# EasyEDA Pro project water-meter-v1.eprj, board PCB1
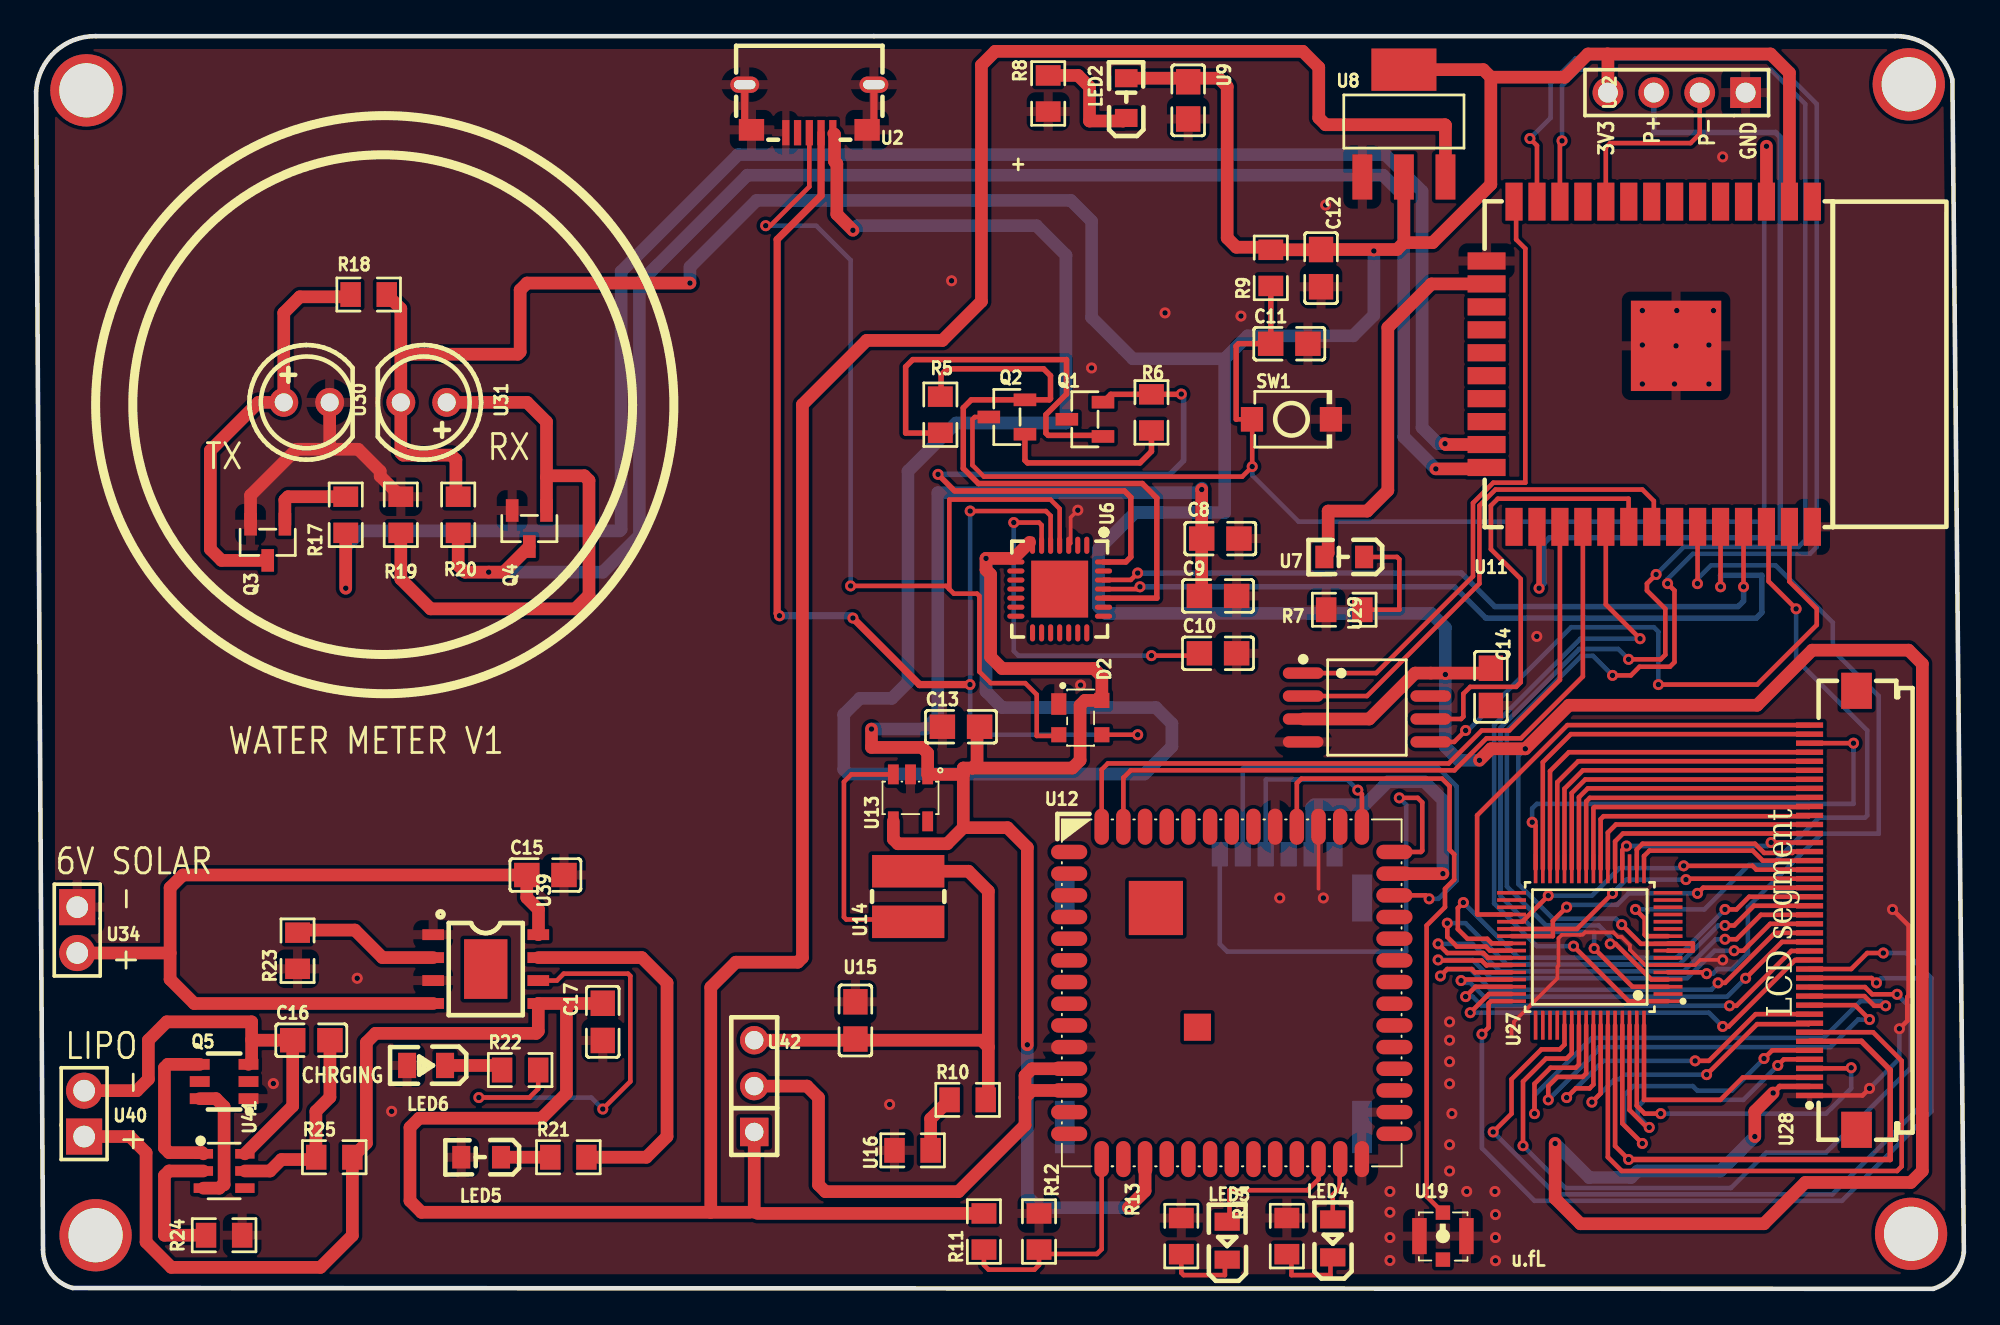
[diagram p1: board, top side]
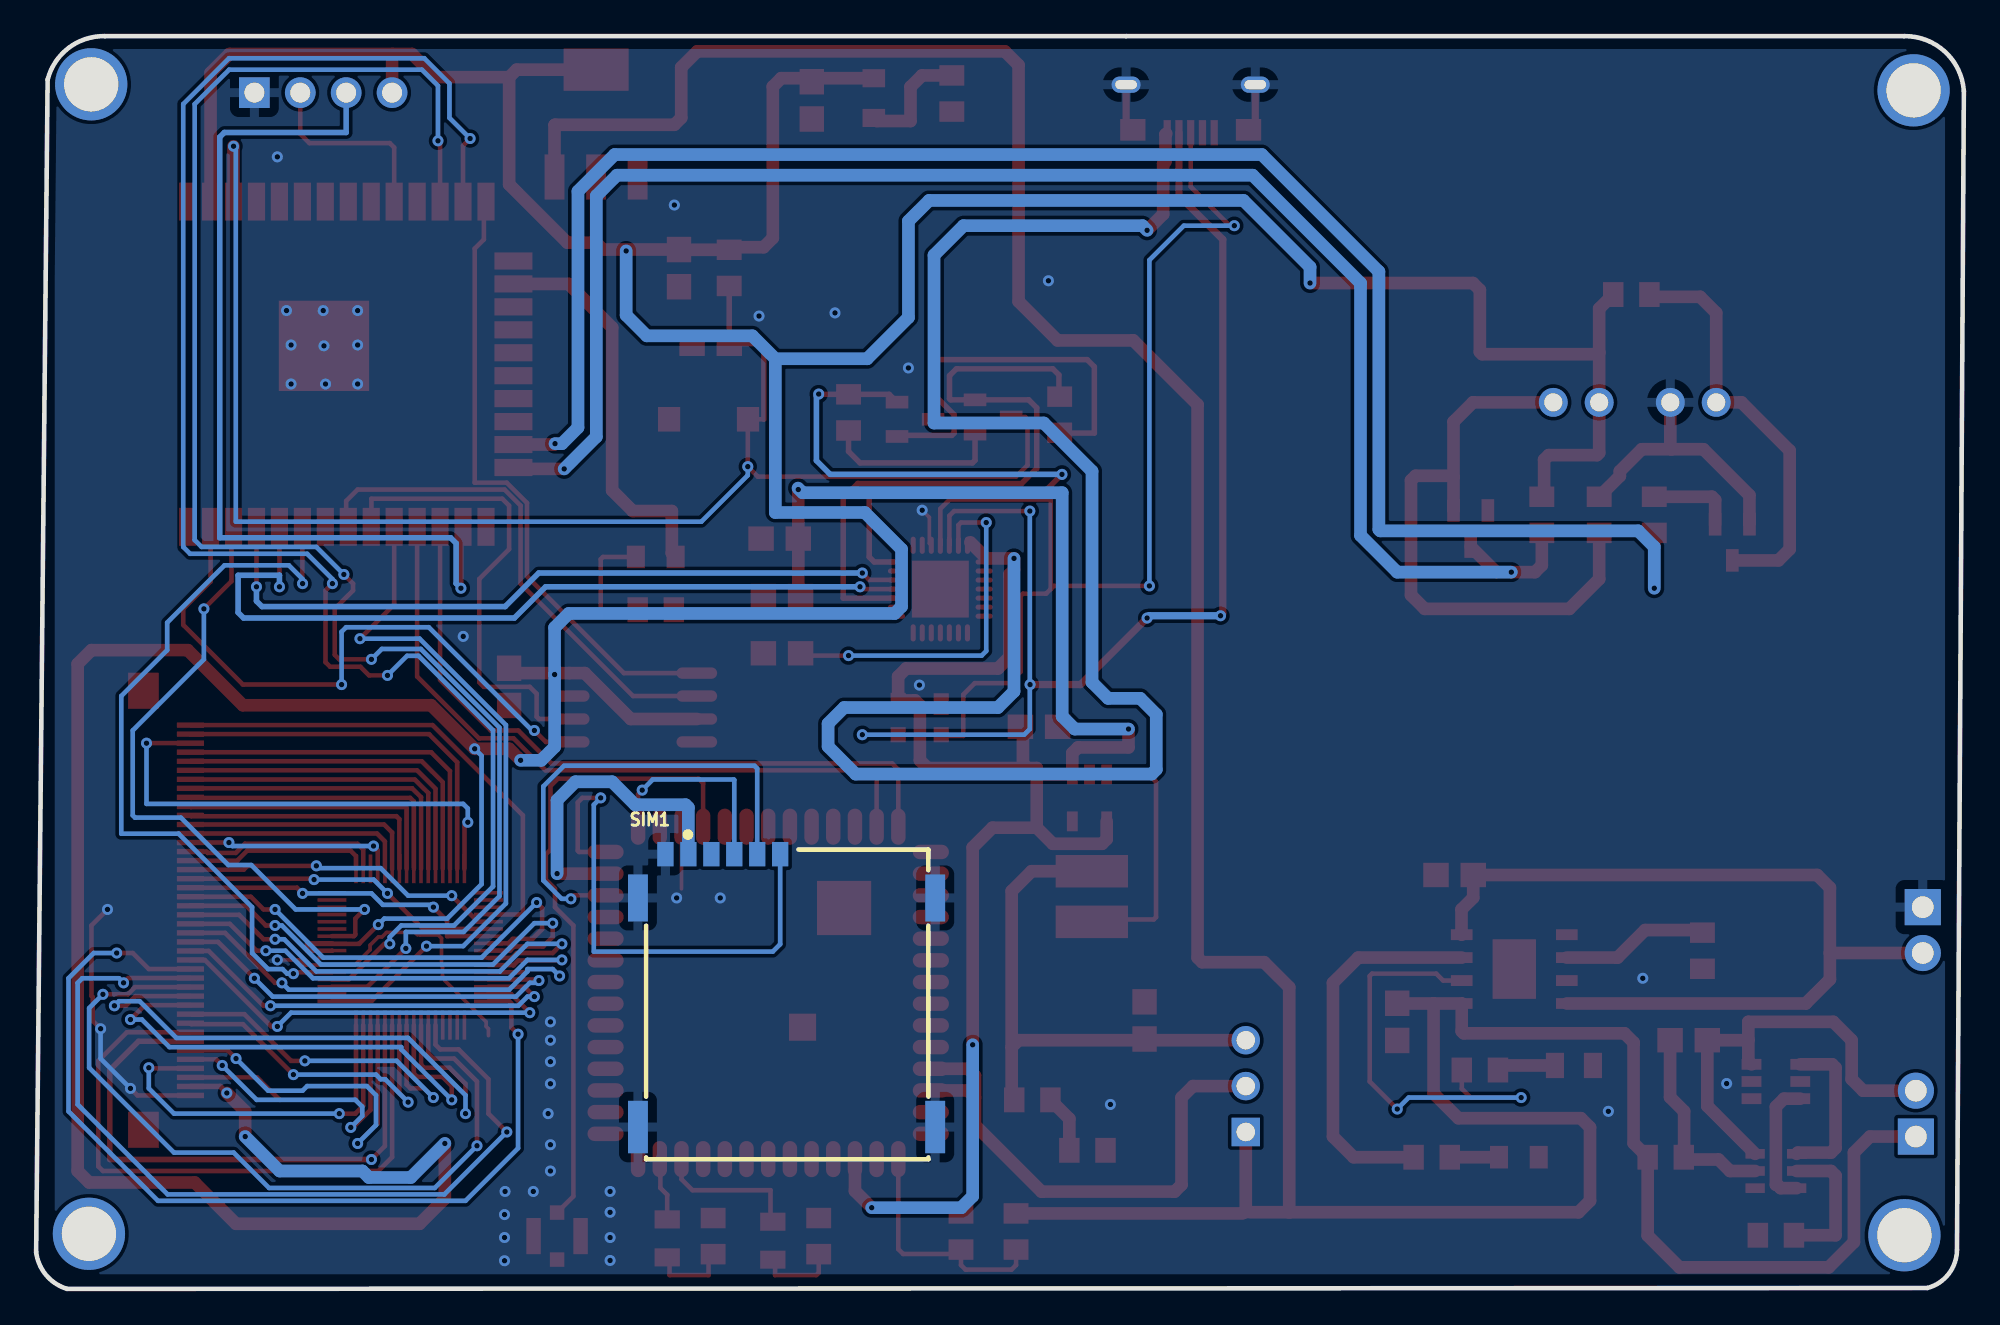
[diagram p2: board, bottom side, seen from below]

Outline 106.68 x 69.34 mm; copper layers: Top Layer, Bottom Layer. Coordinates in mm from the lower left corner of the outline.
Outline path: 0,66.29 0.38,2.16 arc(0.84,0.83) 2.02,0.05 104.97,0 arc(106.13,0.76) 106.68,2.03 106.05,66.93 arc(104.89,68.69) 102.88,69.34 3.3,69.34 arc(1.04,68.48) 0,66.29
Stack: Top Layer 0.035mm / Dielectric1 1.51mm FR4 er 4.5 / Bottom Layer 0.035mm

## Design rules (mm)
template: Custom Config
spacing copperThickness1oz (default): track to track 0.102, other pairs 0.152 to 0.3
spacing copperThickness2oz: track to track 0.203, other pairs 0.152 to 0.3
track width copperThickness1oz (default): min 0.127, default 0.254, max 2.54
track width copperThickness2oz: min 0.203, default 0.254, max 2.54
track width power: min 0.7, default 0.7, max 2.54
differential pair differentialPair (default): width min 0.127, default 0.254, max 2.54; gap min 0.152, default 0.152
via viaSize (default): diameter min 0.5, default 0.61, max 10; hole min 0.3, default 0.305, max 6.3
net VBUS uses power
net 3V3 uses power
net VSIM uses power

## Placement (name value [footprint] x y rotation side)
C8  1uF  [C0805]  65.53 41.53 0 top
C9  0.1uF  [C0805]  65.41 38.35 0 top
C10  0.1uF  [C0805]  65.41 35.18 0 top
C11  1uF  [C0805]  69.35 52.31 0 top
C12  10uF  [C0805]  71.11 56.5 270 top
C13  10uF  [C0805]  51.18 31.12 0 top
C14  100nF  [C0805]  80.51 33.32 270 top
C15  0.1uF  [C0805]  28.18 22.91 0 top
C16  0.1uF  [C0805]  15.23 13.76 0 top
C17  0.1uF  [C0805]  31.36 14.78 270 top
D2  SP0503BAHTG  [SOT-143-4_L2.9-W1.3-P1.92-LS2.4-BL]  57.78 31.62 270 top
LED2  D-R080508L3-KS2  [LED0805-RD]  60.32 65.91 90 top
LED3  KT-0805YG  [LED0805-R-RD]  65.91 2.67 90 top
LED4  KT-0805YG  [LED0805-R-RD]  71.75 2.79 90 top
LED5  RED  [LED0805-RD]  24.63 7.29 180 top
LED6  GRN  [LED0805-R-RD_GREEN]  21.58 12.37 180 top
NOREF  -  [Pad_e70]  103.76 3.05 0 top
NOREF#2  -  [Pad_e69]  103.63 66.68 0 top
NOREF#3  -  [Pad_e66]  2.78 66.34 0 top
NOREF#4  -  [Pad_e71]  3.29 2.97 0 top
Q1  MMBT2222A  [SOT-23-3_L2.9-W1.3-P1.90-LS2.4-BR]  58.04 48.13 0 top
Q2  MMBT2222A  [SOT-23-3_L2.9-W1.3-P1.90-LS2.4-BR]  53.72 48.26 0 top
Q3  MMBT2222A  [SOT-23-3_L2.9-W1.3-P1.90-LS2.4-BR]  12.81 41.32 90 top
Q4  MMBT2222A  [SOT-23-3_L2.9-W1.3-P1.90-LS2.4-BR]  27.29 42.09 90 top
Q5  FS8205A  [SOT-23-6_L2.9-W1.6-P0.95-LS2.8-BR]  10.4 11.48 0 top
R5  10kΩ  [R0805]  50.04 48.39 270 top
R6  10kΩ  [R0805]  61.72 48.51 270 top
R7  10kΩ  [R0805]  72.39 37.59 0 top
R8  10kΩ  [R0805]  56.01 66.17 90 top
R9  10kΩ  [R0805]  68.33 56.52 90 top
R10  330kΩ  [R0805]  51.55 10.46 0 top
R11  200kΩ  [R0805]  52.45 3.18 90 top
R12  100kΩ  [R0805]  55.5 3.18 270 top
R13  1kΩ  [R0805]  63.37 2.92 270 top
R14  1kΩ  [R0805]  69.22 2.92 270 top
R17  1kΩ  [R0805]  17.13 42.85 90 top
R18  270Ω  [R0805]  18.4 55.04 0 top
R19  100kΩ  [R0805]  20.18 42.85 270 top
R20  270Ω  [R0805]  23.36 42.85 90 top
R21  1kΩ  [R0805]  29.45 7.29 0 top
R22  1kΩ  [R0805]  26.78 12.11 0 top
R23  1.2kΩ  [R0805]  14.47 18.72 90 top
R24  1kΩ  [R0805]  10.4 2.97 0 top
R25  120Ω  [R0805]  16.5 7.29 0 top
SIM1  MICRO SIM 6P H1.35  [SIM-SMD_MICRO-SIM-6P-H1.35]  65.15 16.51 180 bottom
SW1  TS-1088R-02526  [SW-SMD_L3.9-W3.0-P4.45]  69.47 48.13 0 top
U2  USB-111HJ-B-CU  [MICRO-USB-SMD_HOOYA_USB-111HJ-B-CU]  42.79 65.33 180 top
U6  CP2102-GM  [QFN-28_L5.0-W5.0-P0.50-TL-EP3.2]  56.64 38.73 270 top
U7  YLED0805R  [LED0805-RD]  72.39 40.51 180 top
U8  AMS1117-3.3  [SOT-223-3_L6.5-W3.4-P2.30-LS7.0-BR]  75.69 64.52 270 top
U9  22uF  [C0805]  63.75 65.79 90 top
U11  ESP32-WROOM-32D-N4  [WIFIM-SMD_39P-L25.5-W18.0-P1.27-BL]  89.28 51.18 180 top
U12  A9G  [GSM-SMD_A9-GSM-GPRSMODULE]  66.17 16.38 0 top
U13  SY8089AAAC  [SOT-23-5_L3.0-W1.7-P0.95-LS2.8-BR]  48.39 27.18 90 top
U14  2.2uH  [IND-SMD_L4.5-W4.0_SLF0403-1]  48.26 21.72 90 top
U15  22uF  [C0805]  45.34 14.86 270 top
U16  56.2kΩ  [R0805]  48.5 7.67 0 top
U19  IPEX-1  [IPEX-SMD_4P-L2.6-W2.6-LS3.0]  77.85 2.92 180 top
U27  HT1622  [LQFP-64_L7.0-W7.0-P0.40-LS9.2-BL]  85.98 18.92 90 top
U28  FPC-0.5FX-42PH20  [FPC-SMD_42P-P0.50_YUANDI_FPC-0.5FX-42PH20]  99.44 20.96 90 top
U29  W25Q128JVSIQ  [SOIC-8_L5.3-W5.3-P1.27-LS8.0-BL]  73.65 32.18 270 top
U30  TSHG8200  [LED-TH_BD5.0-P2.54-FD-1]  14.97 49.07 0 top
U31  TSHG8200  [LED-TH_BD5.0-P2.54-FD-1]  21.45 49.07 180 top
U32  2.54-1*4  [HDR-TH_4P-P2.54-V-M-1]  90.79 66.22 180 top
U34  2.54-1*2  [HDR-TH_2P-P2.54-V-M]  2.27 19.86 270 top
U39  TP4056  [ESOP-8_L4.9-W3.9-P1.27-LS6.0-BL-EP]  24.88 17.7 270 top
U40  3.7V LiPo Battery  [HDR-TH_2P-P2.54-V-M]  2.66 9.7 90 top
U41  DW01A  [SOT-23-6_L2.9-W1.6-P0.95-LS2.8-BL]  10.4 6.53 270 top
U42  PM2.54-1*3  [HDR-TH_3P-P2.54-V-F]  39.74 11.22 90 top

## Footprints (pads in the part's own frame, mm; a bottom-side part is the same pattern mirrored in y, then rotated)
C0805
  rect 1.41x1.35 smd: 1(-1.03,0) 2(1.03,0)
ESOP-8_L4.9-W3.9-P1.27-LS6.0-BL-EP
  rect 0.6x1.2 smd: 1(-1.905,-2.909) 2(-0.635,-2.909) 3(0.635,-2.909) 4(1.905,-2.909) 5(1.905,2.909) 6(0.635,2.909) 7(-0.635,2.909) 8(-1.905,2.909)
  rect 3.3x2.4 smd: 9(0,0)
FPC-SMD_42P-P0.50_YUANDI_FPC-0.5FX-42PH20
  rect 0.3x1.5 smd: 1(-10.25,1.3) 2(-9.75,1.3) 3(-9.25,1.3) 4(-8.75,1.3) 5(-8.25,1.3) 6(-7.75,1.3) 7(-7.25,1.3) 8(-6.75,1.3) 9(-6.25,1.3) 10(-5.75,1.3) 11(-5.25,1.3) 12(-4.75,1.3) 13(-4.25,1.3) 14(-3.75,1.3) 15(-3.25,1.3) 16(-2.75,1.3) 17(-2.25,1.3) 18(-1.75,1.3) 19(-1.25,1.3) 20(-0.75,1.3) 21(-0.25,1.3) 22(0.25,1.3) 23(0.75,1.3) 24(1.25,1.3) 25(1.75,1.3) 26(2.25,1.3) 27(2.75,1.3) 28(3.25,1.3) 29(3.75,1.3) 30(4.25,1.3) 31(4.75,1.3) 32(5.25,1.3) 33(5.75,1.3) 34(6.25,1.3) 35(6.75,1.3) 36(7.25,1.3) 37(7.75,1.3) 38(8.25,1.3) 39(8.75,1.3) 40(9.25,1.3) 41(9.75,1.3) 42(10.25,1.3)
  rect 2x1.7 smd: 43(12.15,-1.3) 44(-12.15,-1.3)
GSM-SMD_A9-GSM-GPRSMODULE
  oval 2x0.8 smd: 1(-9,7.8) 2(-9,6.6) 3(-9,5.4) 4(-9,4.2) 5(-9,3) 6(-9,1.8) 7(-9,0.6) 8(-9,-0.6) 9(-9,-1.8) 10(-9,-3) 11(-9,-4.2) 12(-9,-5.4) 13(-9,-6.6) 14(-9,-7.8) 28(9,-7.8) 29(9,-6.6) 30(9,-5.4) 31(9,-4.2) 32(9,-3) 33(9,-1.8) 34(9,-0.6) 35(9,0.6) 36(9,1.8) 37(9,3) 38(9,4.2) 39(9,5.4) 40(9,6.6) 41(9,7.8)
  oval 0.8x2 smd: 15(-7.2,-9.2) 16(-6,-9.2) 17(-4.8,-9.2) 18(-3.6,-9.2) 19(-2.4,-9.2) 20(-1.2,-9.2) 21(0,-9.2) 22(1.2,-9.2) 23(2.4,-9.2) 24(3.6,-9.2) 25(4.8,-9.2) 26(6,-9.2) 27(7.2,-9.2) 42(7.2,9.2) 43(6,9.2) 44(4.8,9.2) 45(3.6,9.2) 46(2.4,9.2) 47(1.2,9.2) 48(0,9.2) 49(-1.2,9.2) 50(-2.4,9.2) 51(-3.6,9.2) 52(-4.8,9.2) 53(-6,9.2) 54(-7.2,9.2)
  rect 3x3 smd: 55(-4.2,4.7)
  rect 1.5x1.5 smd: 56(-1.9,-1.9)
HDR-TH_2P-P2.54-V-M
  rect 2x2 hole 1.2: 1(-1.27,0)
  round 2 hole 1.2: 2(1.27,0)
HDR-TH_3P-P2.54-V-F
  rect 1.575x1.575 hole 1.02: 1(-2.54,0)
  round 1.575 hole 1.02: 2(0,0) 3(2.54,0)
HDR-TH_4P-P2.54-V-M-1
  rect 1.7x1.7 hole 1.1: 1(-3.81,0)
  round 1.7 hole 1.1: 2(-1.27,0) 3(1.27,0) 4(3.81,0)
IND-SMD_L4.5-W4.0_SLF0403-1
  rect 1.8x4 smd: 1(-1.4,0) 2(1.4,0)
IPEX-SMD_4P-L2.6-W2.6-LS3.0
  rect 0.8x2 smd: 1(-1.3,0) 3(1.3,0)
  rect 0.8x0.8 smd: 2(0,1.3) 4(0.001,-1.3)
LED0805-R-RD
  rect 1x1.399 smd: 1(1.05,0) 2(-1.05,0)
LED0805-R-RD_GREEN
  rect 1x1.399 smd: 1(1.05,0) 2(-1.05,0)
LED0805-RD
  rect 1x1.25 smd: 1(-1.1,0) 2(1.1,0)
LED-TH_BD5.0-P2.54-FD-1
  round 1.6 hole 1: 1(-1.27,0) 2(1.27,0)
LQFP-64_L7.0-W7.0-P0.40-LS9.2-BL
  rect 0.2x1.6 smd: 1(-3,-4.33) 2(-2.6,-4.33) 3(-2.2,-4.33) 4(-1.8,-4.33) 5(-1.4,-4.33) 6(-1,-4.33) 7(-0.6,-4.33) 8(-0.2,-4.33) 9(0.2,-4.33) 10(0.6,-4.33) 11(1,-4.33) 12(1.4,-4.33) 13(1.8,-4.33) 14(2.2,-4.33) 15(2.6,-4.33) 16(3,-4.33) 33(3,4.33) 34(2.6,4.33) 35(2.2,4.33) 36(1.8,4.33) 37(1.4,4.33) 38(1,4.33) 39(0.6,4.33) 40(0.2,4.33) 41(-0.2,4.33) 42(-0.6,4.33) 43(-1,4.33) 44(-1.4,4.33) 45(-1.8,4.33) 46(-2.2,4.33) 47(-2.6,4.33) 48(-3,4.33)
  rect 1.6x0.2 smd: 17(4.33,-3) 18(4.33,-2.6) 19(4.33,-2.2) 20(4.33,-1.8) 21(4.33,-1.4) 22(4.33,-1) 23(4.33,-0.6) 24(4.33,-0.2) 25(4.33,0.2) 26(4.33,0.6) 27(4.33,1) 28(4.33,1.4) 29(4.33,1.8) 30(4.33,2.2) 31(4.33,2.6) 32(4.33,3) 49(-4.33,3) 50(-4.33,2.6) 51(-4.33,2.2) 52(-4.33,1.8) 53(-4.33,1.4) 54(-4.33,1) 55(-4.33,0.6) 56(-4.33,0.2) 57(-4.33,-0.2) 58(-4.33,-0.6) 59(-4.33,-1) 60(-4.33,-1.4) 61(-4.33,-1.8) 62(-4.33,-2.2) 63(-4.33,-2.6) 64(-4.33,-3)
MICRO-USB-SMD_HOOYA_USB-111HJ-B-CU
  rect 0.4x1.4 smd: 1(-1.3,1.33) 2(-0.65,1.33) 3(0,1.33) 4(0.65,1.33) 5(1.3,1.33)
  rect 1.4x1.2 smd: 6(3.2,1.17) 7(-3.2,1.17)
  oval 1.6x0.9 hole 1.2x0.5: 8(-3.575,-1.33) 9(3.575,-1.33)
Pad_e66
  round 4 hole 3: 65(0,0)
Pad_e69
  round 4 hole 3: 65(0,0)
Pad_e70
  round 4 hole 3: 65(0,0)
Pad_e71
  round 4 hole 3: 65(0,0)
QFN-28_L5.0-W5.0-P0.50-TL-EP3.2
  oval 0.95x0.28 smd: 1(-2.425,1.502) 2(-2.425,1.001) 3(-2.425,0.5) 4(-2.425,0) 5(-2.425,-0.5) 6(-2.425,-1) 7(-2.425,-1.501) 15(2.425,-1.501) 16(2.425,-1) 17(2.425,-0.5) 18(2.425,0) 19(2.425,0.5) 20(2.425,1.001) 21(2.425,1.502)
  oval 0.28x0.95 smd: 8(-1.502,-2.425) 9(-1.001,-2.425) 10(-0.5,-2.425) 11(0,-2.425) 12(0.5,-2.425) 13(1,-2.425) 14(1.501,-2.425) 22(1.501,2.425) 23(1,2.425) 24(0.5,2.425) 25(0,2.425) 26(-0.5,2.425) 27(-1.001,2.425) 28(-1.502,2.425)
  rect 3.15x3.15 smd: 29(0,0)
R0805
  rect 1.133x1.377 smd: 1(-1,0) 2(1,0)
SIM-SMD_MICRO-SIM-6P-H1.35
  rect 0.9x1.35 smd: 1(-5.435,7.553) 2(-2.895,7.553) 3(-0.355,7.553) 5(-6.705,7.553) 6(-4.165,7.553) 7(-1.625,7.553)
  rect 1.1x2.6 smd: 8(-8.225,5.128) 11(8.225,5.128)
  rect 1.1x2.9 smd: 9(-8.225,-7.553) 10(8.225,-7.553)
SOIC-8_L5.3-W5.3-P1.27-LS8.0-BL
  oval 0.63x2.25 smd: 1(-1.905,-3.53) 2(-0.635,-3.53) 3(0.635,-3.53) 4(1.905,-3.53) 5(1.905,3.53) 6(0.635,3.53) 7(-0.635,3.53) 8(-1.905,3.53)
SOT-23-3_L2.9-W1.3-P1.90-LS2.4-BR
  rect 1.25x0.7 smd: 1(1,-0.95) 2(1,0.95) 3(-1,0)
SOT-23-5_L3.0-W1.7-P0.95-LS2.8-BR
  rect 1.1x0.6 smd: 1(1.3,-0.95) 2(1.3,0) 3(1.3,0.95) 4(-1.3,0.95) 5(-1.3,-0.95)
SOT-23-6_L2.9-W1.6-P0.95-LS2.8-BL
  rect 0.532x1.072 smd: 1(-0.95,-1.149) 2(0,-1.149) 3(0.95,-1.149) 4(0.95,1.149) 5(0,1.149) 6(-0.95,1.149)
SOT-23-6_L2.9-W1.6-P0.95-LS2.8-BR
  rect 1.1x0.6 smd: 1(1.35,-0.95) 2(1.35,0) 3(1.35,0.95) 4(-1.35,0.95) 5(-1.35,0) 6(-1.35,-0.95)
SOT-143-4_L2.9-W1.3-P1.92-LS2.4-BL
  rect 1.194x0.838 smd: 1(-0.75,-1.192)
  rect 0.838x0.838 smd: 2(0.95,-1.192) 3(0.95,1.192) 4(-0.95,1.192)
SOT-223-3_L6.5-W3.4-P2.30-LS7.0-BR
  rect 2.5x1.1 smd: 1(2.97,-2.3) 2(2.97,0) 3(2.97,2.3)
  rect 2.34x3.6 smd: 4(-2.97,0)
SW-SMD_L3.9-W3.0-P4.45
  rect 1.23x1.36 smd: 1(-2.185,0) 2(2.185,0)
WIFIM-SMD_39P-L25.5-W18.0-P1.27-BL
  rect 0.95x2.1 smd: 1(-9.015,-9) 2(-7.745,-9) 3(-6.475,-9) 4(-5.205,-9) 5(-3.935,-9) 6(-2.665,-9) 7(-1.395,-9) 8(-0.125,-9) 9(1.145,-9) 10(2.415,-9) 11(3.685,-9) 12(4.955,-9) 13(6.225,-9) 14(7.495,-9) 25(7.495,9) 26(6.225,9) 27(4.955,9) 28(3.685,9) 29(2.415,9) 30(1.145,9) 31(-0.125,9) 32(-1.395,9) 33(-2.665,9) 34(-3.935,9) 35(-5.205,9) 36(-6.475,9) 37(-7.745,9) 38(-9.015,9)
  rect 2.1x0.95 smd: 15(9.015,-5.715) 16(9.015,-4.445) 17(9.015,-3.175) 18(9.015,-1.905) 19(9.015,-0.635) 20(9.015,0.635) 21(9.015,1.905) 22(9.015,3.175) 23(9.015,4.445) 24(9.015,5.715)
  rect 5x5 smd: 39(-1.472,-1.017)

## Nets
As in the schematic.

Pads without a net: NOREF 65; NOREF#2 65; NOREF#3 65; NOREF#4 65; Q5 2 5; SIM1 6; U2 4; U6 1 2 9 10 11 12 13 14 15 16 17 18 19 20 21 22 29; U11 1 4 5 6 7 8 9 11 17 18 19 20 21 22 25 32; U12 1 2 3 4 5 6 7 8 9 13 14 16 18 19 20 21 22 23 24 28 30 31 32 33 34 35 36 37 38 43 47 48 51 52 55 56; U13 5; U19 2; U27 2 7 11 12 13 14 15 16 19 33 34 35 49 50 51 52; U28 43 44; U29 7; U39 9; U41 4

## Via types
v1: diameter 0.61, hole 0.305, Top Layer to Bottom Layer, 150 vias

## Routing (per net, layer and track width the routed paths; a pad name or vN(x,y) marks a point on that pad's centre or on a via; arc(x,y) is an arc through that point)
3V3: length 337.5
  Top Layer w0.254: 91.68,19.12 91.66,19.1 88.81,19.1 v1(87.75,20.16) ; 91.68,19.12 U27.9 ; 91.68,19.12 91.68,18.72 90.31,18.72 90.31,18.72
  Top Layer w0.305: U28.2 96.49,11.21 v1(96.13,10.84)
  Top Layer w0.7: 63.56,67.01 U9.2 ; 63.56,67.01 LED2.2 ; 63.56,67.01 65.45,67.01 65.91,66.55 65.91,58.17 66.42,57.66 68.18,57.66 R9.2 71.09,57.52 C12.1 75.31,57.53 75.69,57.91 ; R18.2 20.18,54.26 20.18,51.82 ; U29.3 73.78,31.54 76.31,34.08 U29.8 80.24,34.08 C14.1 ; U32.4 86.98,68.34 86.97,68.35 ; 75.69,57.91 U8.2 ; 75.69,57.91 77.28,57.91 80.5,61.13 80.5,67.07 ; v1(79.87,29.26) 80.51,29.89 v1(82.41,29.89) 84.82,32.31 95.24,32.31 98.29,35.35 103.62,35.35 104.38,34.59 104.38,6.53 103.75,5.89 97.91,5.89 95.62,3.6 85.46,3.6 84.06,5 v1(84.06,8.05) ; v1(96.13,10.84) 95.11,9.83 v1(95.11,8.43) ; 86.97,68.35 95.98,68.35 97.03,67.31 U11.2 ; 86.97,68.35 85.88,68.35 84.6,67.07 80.5,67.07 ; U8.4 80.09,67.49 80.5,67.07 ; 20.18,51.82 U31.2 20.18,46.28 20.31,46.15 22.98,46.15 23.23,45.9 23.23,43.97 R20.2 ; 20.18,51.82 20.27,51.74 26.66,51.74 26.78,51.86 26.78,55.29 27.17,55.67 v1(36.18,55.67)
  Bottom Layer w0.254: v1(87.75,20.16) 87.41,20.5 83.94,20.5 82.03,22.4 82.03,29.51 v1(82.41,29.89)
  Bottom Layer w0.7: v1(74.03,57.45) 74.03,53.9 72.89,52.75 67.04,52.75 65.77,51.48 ; v1(84.06,8.05) 85.95,6.16 88.26,6.16 88.62,6.53 93.21,6.53 v1(95.11,8.43) ; 65.77,51.48 65.77,42.97 60.82,42.97 58.79,40.94 58.79,37.77 59.17,37.39 77.2,37.39 77.99,36.6 v1(77.99,34.01) 77.99,30 78.73,29.26 v1(79.87,29.26) ; 65.77,51.48 60.69,51.48 58.41,53.77 58.41,59.1 57.27,60.25 39.87,60.25 36.18,56.56 v1(36.18,55.67)
4.2V: length 29.7
  Top Layer w0.7: U42.2 42.66,11.22 43.3,10.59 43.3,5.76 43.68,5.38 51.04,5.38 54.72,9.07 54.72,10.59 ; 54.72,10.59 54.72,11.8 55.11,12.18 U12.11 ; 54.72,10.59 55.12,10.98 U12.12
6V_SOLAR_IN: length 48.9
  Top Layer w0.7: U34.2 7.41,18.59 ; 7.41,18.59 7.41,22.21 8.12,22.91 C15.1 27.15,21.65 27.8,21 27.8,19.62 U39.8 ; 7.41,18.59 7.41,17.13 8.75,15.8 U39.4
GND: length 57.1
  Top Layer w0.203: v1(57.65,43.1) 57.25,42.7 57.25,41.27 U6.3 ; v1(93.33,18.21) 92.09,18.21 91.81,17.92 U27.6 89.05,17.92 88.2,18.77 88.2,19.02 87.75,19.48 87.54,19.48 87.29,19.73 85.71,19.73 85.59,19.61 85.46,19.61 85.45,19.59 84.43,19.59 84.25,19.41 84.25,17.88 84.19,17.83 84.19,17.19 81.78,14.78 81.78,14.53 81.65,14.4 81.65,14.02 ; U12.44 70.97,22.15
  Top Layer w0.254: v1(102.73,21) 103.62,20.11 103.62,16.22 103.55,16.15 103.55,14.84 v1(103.11,14.4) ; v1(101.46,11.1) 101.07,10.71 U28.1
  Top Layer w0.4: U2.8 46.36,64.53 U2.7 ; 39.21,66.66 39.21,64.53 U2.6
  Top Layer w0.7: 16.19,46.47 14.41,46.47 11.87,43.93 Q3.2 ; 16.19,46.47 16.24,46.53 U30.2 ; 16.19,46.47 17.83,46.47 19.04,45.26 19.04,44.99 R19.1
  Bottom Layer w0.254: v1(103.11,14.4) 103.11,12.75 v1(101.46,11.1)
  vias: v1(13.13,11.36) v1(17.77,17.19) v1(19.67,9.83) v1(47.23,10.21) v1(50.66,55.8) v1(57.8,33.42) v1(58.41,50.98) v1(62.47,54.02) v1(66.68,53.85) v1(68.82,21.64) v1(71.24,21.64) v1(71.36,59.99) v1(74.92,5.39) v1(74.92,4.24) v1(74.92,2.84) v1(74.92,1.57) v1(78.22,14.78) v1(78.22,13.76) v1(78.22,12.57) v1(78.22,11.35) v1(78.22,7.98) v1(78.22,6.53) v1(78.35,9.7) v1(79.17,5.39) v1(80.73,5.39) v1(80.76,4.11) v1(80.76,2.84) v1(80.76,1.56) v1(83.05,36.12) v1(88.89,54.15) v1(88.89,52.25) v1(88.89,50.09) v1(90.67,50.09) v1(90.79,54.15) v1(90.75,52.2) v1(92.57,52.25) v1(92.57,50.09) v1(92.82,54.15) v1(93.33,62.66)
VBUS: length 210.1
  Top Layer w0.7: C13.2 52.07,30.97 52.07,29.08 51.82,28.83 ; U12.17 61.37,5.42 v1(60.44,4.49) ; 51.31,25.53 50.42,24.64 47.69,24.64 47.44,24.89 U13.4 ; 51.31,25.53 53.76,25.53 54.85,24.43 v1(54.85,13.51) ; 51.31,25.53 51.31,28.49 ; v1(45.2,58.6) 44.31,59.48 44.31,62.28 44.18,62.41 44.18,63.9 44.14,63.94 ; 51.82,28.83 51.31,28.83 51.31,28.49 ; 51.82,28.83 57.34,28.83 57.77,29.26 57.77,32.31 58.04,32.57 D2.4 58.98,33.9 58.53,34.34 53.46,34.34 52.82,34.97 52.82,39.55 52.57,39.8 v1(52.57,40.43) 54.09,40.43 54.98,41.32 ; 51.31,28.49 51.3,28.48 U13.1 49.34,29.66 49.02,29.97 46.23,29.97 v1(46.23,30.99) ; v1(64.5,44.24) 64.5,44.25 C8.1 64.5,38.48 C9.1
  Bottom Layer w0.7: v1(46.23,30.99) 49.2,30.99 49.9,31.69 49.9,44.07 64.26,44.07 64.52,44.32 ; v1(52.57,40.43) 52.57,33.07 53.46,32.18 61.96,32.18 62.85,31.29 62.85,30.02 61.33,28.5 44.95,28.5 44.69,28.75 44.69,31.8 45.58,32.69 47.36,32.69 48.25,33.58 48.25,45.26 50.91,47.93 56.99,47.93 56.99,57.22 55.36,58.85 45.45,58.85 v1(45.2,58.6) ; v1(60.44,4.49) 55.49,4.49 54.85,5.13 v1(54.85,13.51)
VBUS_4.2: length 29.7
  Top Layer w0.7: 45.27,13.76 52.31,13.76 52.69,13.38 ; 45.27,13.76 U42.3 ; 45.27,13.76 U15.2 ; 52.69,13.38 52.69,22.02 51.59,23.12 48.26,23.12 ; 52.69,13.38 52.69,10.61 R10.2
ADC0: length 13.5
  Top Layer w0.254: U12.15 58.97,2.2 58.7,1.93 55.5,1.93 ; 55.5,1.93 R12.2 ; 55.5,1.93 55.5,1.32 55.25,1.06 52.71,1.06 52.45,1.32 R11.1
BATT+: length 208.2
  Top Layer w0.7: 77.99,61.55 77.99,64.41 77.97,64.44 71.36,64.44 70.98,64.82 70.98,67.61 70.09,68.5 53.07,68.5 52.31,67.74 52.31,54.66 50.15,52.5 45.96,52.5 42.41,48.94 42.41,18.34 42.15,18.08 38.72,18.08 37.34,16.69 37.34,4.24 ; C17.1 31.34,15.8 29.35,15.8 ; 29.35,15.8 29.35,10.82 27.97,9.45 21.2,9.45 20.69,8.94 20.69,4.87 21.32,4.24 37.34,4.24 ; 29.35,15.8 U39.5 27.79,14.26 27.67,14.15 18.78,14.15 18.28,13.64 18.28,8.06 R25.2 17.5,2.95 15.74,1.19 7.48,1.19 6.08,2.59 6.08,7.54 5.2,8.43 U40.1 ; 37.34,4.24 39.49,4.24 ; 39.74,4.24 U42.1 ; 39.93,4.18 R11.2
BATT-: length 24.2
  Top Layer w0.7: 11.93,13.78 11.93,12.6 Q5.3 ; 11.93,13.78 11.93,14.78 7.23,14.78 6.21,13.76 6.21,11.61 5.58,10.97 U40.2 ; 11.93,13.78 11.94,13.76 C16.1 14.2,10.12 U41.6
COM0: length 10.2
  Top Layer w0.254: U27.17 88.98,23.96 89.28,24.26 95,24.26 95.55,23.71 U28.27
COM1: length 11
  Top Layer w0.254: U28.28 97.26,24.21 97.19,24.13 95.63,24.13 95.12,24.64 88.9,24.64 88.58,24.32 U27.18
COM2: length 11.6
  Top Layer w0.254: U28.29 v1(96.01,24.71) ; v1(88.01,24.51) 87.78,24.28 U27.20
  Bottom Layer w0.254: v1(96.01,24.71) 95.82,24.51 v1(88.01,24.51)
COM3: length 12.5
  Top Layer w0.254: U28.30 87.82,25.21 87.38,24.77 U27.21
COM4: length 13.4
  Top Layer w0.254: U27.22 86.98,25.26 87.43,25.71 U28.31
COM5: length 14.4
  Top Layer w0.254: U28.32 98.1,26.16 86.74,26.16 86.58,26 U27.23
COM6: length 15.4
  Top Layer w0.254: U28.33 98.11,26.67 86.23,26.67 86.18,26.62 U27.24
COM7: length 16.2
  Top Layer w0.254: U27.25 85.78,26.98 85.98,27.18 98.11,27.18 U28.34
DTR: length 38.3
  Top Layer w0.305: Q1.2 59.47,49.51 R6.1 63.36,49.51 v1(63.37,49.53) ; v1(49.91,45.09) 50.83,44.17 60.22,44.17 60.58,43.82 60.58,40.51 60.3,40.24 U6.28
  Bottom Layer w0.305: v1(63.37,49.53) 63.5,49.4 63.5,45.85 62.74,45.09 v1(49.91,45.09)
F_CLK: length 26.4
  Top Layer w0.254: U11.30 88.13,42.19 88.13,43.74 80.89,43.74 80.51,43.36 80.51,40.94 82.16,39.29 82.16,33.58 81.9,33.32 79.36,33.32 78.98,32.94 78.98,31.67 78.85,31.54 U29.6
F_CS: length 34.9
  Top Layer w0.254: U11.14 81.9,60.06 81.9,58.09 82.41,57.58 82.41,44.62 80.64,44.62 79.52,43.5 79.52,39.44 74.16,34.08 U29.1
F_MISO: length 28
  Top Layer w0.254: 89.52,42.52 89.52,43.61 88.89,44.24 80.76,44.24 79.87,43.36 79.87,39.04 73.65,32.81 U29.2
F_MOSI: length 34.4
  Top Layer w0.254: U29.5 78.47,30.27 v1(79.11,30.91) ; U11.37 97.03,39.15 98.54,37.64 98.54,36.75 95.24,33.45 v1(89.78,33.45)
  Bottom Layer w0.254: v1(89.78,33.45) 89.78,36.37 89.52,36.62 84.95,36.62 79.24,30.91 v1(79.11,30.91)
GPRS_RF: length 35.8
  Top Layer w0.254: 77.85,4.22 76.95,5.12 76.95,20.11 77.97,21.13 77.97,22.15 78.47,22.65 78.47,24.05 78.22,24.31 78.22,27.82 77.8,28.24 70.02,28.24 69.77,27.99 U12.45
INBUILT_LED: length 21.9
  Top Layer w0.7: U7.2 71.5,40.72 71.5,43.05 73.66,43.05 74.8,44.2 74.8,53.21 77.22,55.63 U11.16
IO26: length 8.1
  Top Layer w0.254: LED3.1 66.04,3.84 66.04,5.46 70.36,5.46 70.97,6.07 U12.25
IO27: length 3.5
  Top Layer w0.254: LED4.1 71.75,5.21 72.14,5.59 72.14,7.15 U12.26
IR_RX: length 93.6
  Top Layer w0.7: Q4.3 25.88,39.67 v1(25.04,39.67) 23.74,39.67 23.36,40.05 R20.1 ; v1(77.46,45.39) 80.19,45.39 U11.24
  Bottom Layer w0.7: v1(25.04,39.67) 31.36,39.67 33.39,41.7 33.39,55.67 39.36,61.64 74.54,61.64 75.68,60.5 75.68,47.17 v1(77.46,45.39)
IR_TX: length 100.2
  Top Layer w0.7: U11.23 78.01,46.74 v1(77.97,46.78) ; v1(17.13,38.78) R17.1
  Bottom Layer w0.7: v1(77.97,46.78) 77.59,46.78 76.7,47.67 76.7,60.75 74.66,62.79 38.85,62.79 32.37,56.31 32.37,42.04 32.3,41.96 18.02,41.96 17.13,41.07 v1(17.13,38.78)
LCD_CS: length 38.8
  Top Layer w0.254: U27.1 88.13,15.92 v1(85.08,18.97) ; v1(88.76,35.99) 86.87,37.88 U11.29
  Bottom Layer w0.254: v1(88.76,35.99) 85.46,35.99 80.68,31.21 80.68,21.33 83.05,18.97 v1(85.08,18.97)
LCD_DATA: length 41.7
  Top Layer w0.254: v1(92.44,17.45) 92.37,17.52 90.31,17.52 ; U11.33 91.95,39.05 v1(91.94,39.04)
  Bottom Layer w0.254: v1(91.94,39.04) 91.94,39.29 92.7,40.05 96.25,40.05 99.43,36.88 99.43,35.35 101.97,32.81 101.97,25.19 98.79,25.19 94.73,21.13 94.73,18.59 93.84,17.7 93.04,17.7 92.79,17.45 v1(92.44,17.45)
LCD_IRQ: length 36.2
  Top Layer w0.254: v1(88.51,21) 89.02,20.5 89.02,19.61 89.1,19.52 90.31,19.52 ; U11.36 95.87,42.06 95.87,39.16 v1(97.4,37.64)
  Bottom Layer w0.254: v1(97.4,37.64) 97.4,34.85 101.33,30.91 101.33,26.21 101.21,26.08 98.67,26.08 96.04,23.46 94.77,23.46 92.32,21 v1(88.51,21)
LCD_RD: length 91.8
  Top Layer w0.254: v1(89.65,39.55) 89.14,39.04 89.14,38.66 90.16,37.64 90.16,35.1 89.9,34.85 v1(88.13,34.85) ; U11.12 84.33,63.43 v1(84.44,63.55) ; v1(86.22,18.84) 88.34,16.72 90.31,16.72
  Bottom Layer w0.254: v1(84.44,63.55) 84.44,66.6 85.33,67.49 96,67.49 97.91,65.58 97.91,41.45 97.52,41.07 91.17,41.07 v1(89.65,39.55) ; v1(88.13,34.85) 87.55,35.42 85.39,35.42 81.04,31.07 81.04,21.74 83.02,19.76 86.22,19.76 v1(86.22,18.84)
LCD_WR: length 93.4
  Top Layer w0.254: v1(87.24,33.96) 88.25,33.96 88.73,34.44 90.41,34.44 90.67,34.69 90.67,38.66 v1(90.28,39.04) ; U11.13 83.06,63.28 v1(82.66,63.68) ; U27.4 89.38,17.12 87.41,19.1 v1(87.11,19.1)
  Bottom Layer w0.254: v1(82.66,63.68) 83.81,64.82 83.81,66.72 85.21,68.12 96,68.12 98.54,65.58 98.54,41.07 98.16,40.69 91.68,40.69 90.28,39.29 v1(90.28,39.04) ; v1(87.11,19.1) 87.11,19.48 86.47,20.11 83.55,20.11 81.4,22.27 81.4,30.92 85.52,35.04 86.15,35.04 v1(87.24,33.96)
PULSE+: length 50.6
  Top Layer w0.305: U11.26 83.17,42.06 v1(83.17,38.78)
  Bottom Layer w0.305: v1(83.17,38.78) 83.44,39.05 83.44,41.27 83.74,41.58 96.52,41.58 96.52,63.75 96.27,64.01 89.52,64.01 89.52,66.04
PULSE-: length 10.8
  Top Layer w0.254: U11.10 86.87,63.18 87.11,63.42 91.56,63.42 92.06,63.93 U32.2
RESET: length 86.1
  Top Layer w0.254: 67.09,48.13 66.41,48.13 ; 67.09,48.13 SW1.1 ; 67.09,48.13 67.3,47.93 v1(67.3,45.51) 66.74,44.96 52.45,44.96 51.82,45.59 51.82,48.13 51.94,48.26 Q2.3
  Top Layer w0.305: 68.33,52.32 R9.1 ; 68.33,52.32 66.54,52.32 66.41,52.18 66.41,48.13 ; 68.33,52.32 C11.1
  Top Layer w0.7: U11.3 v1(95.76,63.25)
  Bottom Layer w0.254: v1(95.76,63.25) 95.63,63.12 95.63,42.47 69.87,42.47 67.3,45.03 v1(67.3,45.51)
RTS: length 37.2
  Top Layer w0.305: U6.24 62.02,38.23 62.02,43.77 61.21,44.58 52.15,44.58 51.31,45.42 51.31,48.77 51.75,49.21 Q2.2 56.07,49.21 56.13,49.28 56.13,50.55 55.75,50.93 50.42,50.93 50.08,50.59 50.08,49.6 50.29,49.39
RX0: length 45.6
  Top Layer w0.254: 59.07,38.74 60.96,38.74 v1(61.09,38.86) ; U11.34 v1(93.22,38.86)
  Bottom Layer w0.305: v1(61.09,38.86) 78.49,38.86 80.22,37.13 95.2,37.13 95.5,37.44 95.5,39.5 93.22,39.5 93.22,39.5 v1(93.22,38.86)
SEG0: length 16.9
  Top Layer w0.254: U27.26 85.38,27.21 85.87,27.71 U28.35
SEG1: length 17.7
  Top Layer w0.254: U28.36 98.13,28.19 85.72,28.19 84.98,27.45 U27.27
SEG2: length 18.4
  Top Layer w0.254: U28.37 98.14,28.7 85.6,28.7 84.58,27.68 U27.28
SEG3: length 19.2
  Top Layer w0.254: U28.38 85.34,29.21 84.18,28.05 U27.29
SEG4: length 20.2
  Top Layer w0.254: U27.30 83.78,28.66 84.82,29.71 U28.39
SEG5: length 21.3
  Top Layer w0.254: U28.41 84.93,30.71 83.38,29.15 U27.31
SEG6: length 27.1
  Top Layer w0.254: U27.32 82.98,25.64 v1(82.79,25.83) ; U28.40 v1(100.57,30.21)
  Bottom Layer w0.254: v1(82.79,25.83) 82.79,26.59 83.05,26.85 100.57,26.85 v1(100.57,30.21)
SEG7: length 27.8
  Top Layer w0.254: 81.65,20.72 79.77,20.72 79.74,20.75 79.74,26.21 84.74,31.21 U28.42
SEG8: length 17.9
  Top Layer w0.254: U28.26 95.19,23.21 94.98,23.42 v1(91.17,23.42) ; v1(83.68,21.77) 82.24,20.32 U27.37
  Bottom Layer w0.254: v1(91.17,23.42) 91.05,23.29 87.62,23.29 86.09,21.77 v1(83.68,21.77)
SEG9: length 17.6
  Top Layer w0.254: v1(87.24,21.89) 85.27,19.92 U27.38 ; v1(91.3,22.65) 91.35,22.71 U28.25
  Bottom Layer w0.254: v1(87.24,21.89) 88,22.65 v1(91.3,22.65)
SEG10: length 18.1
  Top Layer w0.254: v1(91.94,21.89) 92.25,22.21 U28.24 ; 81.65,19.52 83.94,19.52 83.94,20.37 v1(84.7,21.13)
  Bottom Layer w0.254: v1(91.94,21.89) 88.13,21.89 87.49,21.26 84.82,21.26 v1(84.7,21.13)
SEG11: length 26.7
  Top Layer w0.254: U28.23 94.8,21.71 94.09,21 v1(93.46,21) ; v1(78.98,21.38) 78.68,21.08 78.68,19.91 79.21,19.38 80.3,19.38 80.56,19.12 U27.40
  Bottom Layer w0.254: v1(93.46,21) 90.79,18.34 82.03,18.34 v1(78.98,21.38)
SEG12: length 27
  Top Layer w0.254: v1(78.09,20.24) 78.09,19.48 78.63,18.95 80.23,18.95 80.45,18.72 81.65,18.72 ; U28.22 95.06,21.21 93.97,20.11 v1(93.46,20.11)
  Bottom Layer w0.254: v1(93.46,20.11) 93.08,20.11 90.92,17.96 81.4,17.96 79.11,20.24 v1(78.09,20.24)
SEG13: length 26.9
  Top Layer w0.254: v1(77.59,19.1) 78.09,18.59 80.08,18.59 80.35,18.32 U27.42 ; v1(93.46,19.35) 94.09,19.35 95.45,20.71 U28.21
  Bottom Layer w0.254: v1(77.59,19.1) 79.49,19.1 81.01,17.57 91.17,17.57 92.95,19.35 v1(93.46,19.35)
SEG14: length 26.4
  Top Layer w0.254: v1(93.97,18.72) 94.48,18.72 95.96,20.21 U28.20 ; U27.43 80.28,17.92 80.26,17.91 79.99,18.18 77.62,18.18 v1(77.59,18.21)
  Bottom Layer w0.254: v1(93.97,18.72) 92.89,18.72 91.36,17.19 80.51,17.19 79.49,18.21 v1(77.59,18.21)
SEG15: length 26.6
  Top Layer w0.254: U28.19 96.23,19.71 93.46,16.94 v1(93.08,16.94) ; 81.65,17.52 79.62,17.52 79.44,17.7 78.09,17.7 v1(77.71,17.32)
  Bottom Layer w0.254: v1(77.71,17.32) 78.09,17.7 79.49,17.7 79.49,17.57 80.51,16.56 92.7,16.56 v1(93.08,16.94)
SEG16: length 23.7
  Top Layer w0.254: U28.18 96.62,19.21 v1(94.6,17.19) ; v1(78.85,17.07) 78.91,17.12 U27.45
  Bottom Layer w0.254: v1(78.85,17.07) 78.98,16.94 79.36,16.94 80.12,16.18 93.59,16.18 v1(94.6,17.19)
SEG17: length 23.3
  Top Layer w0.254: v1(79.11,16.18) 79.66,16.72 81.65,16.72 ; v1(93.71,15.67) 94.09,15.67 97.13,18.71 U28.17
  Bottom Layer w0.254: v1(93.71,15.67) 80,15.67 79.49,16.18 v1(79.11,16.18)
SEG18: length 23.3
  Top Layer w0.254: U27.47 80.4,16.32 v1(79.36,15.29) ; U28.16 97.35,18.21 93.67,14.53 v1(93.33,14.53)
  Bottom Layer w0.254: v1(93.33,14.53) 92.57,15.29 v1(79.36,15.29)
SEG19: length 52.7
  Top Layer w0.254: v1(102.22,18.59) 101.33,18.59 100.45,17.71 U28.15 ; v1(80.01,14.1) 80.38,14.47 80.38,15.8 80.51,15.92 U27.48
  Bottom Layer w0.254: v1(80.01,14.1) 80.01,7.78 82.92,4.87 99.94,4.87 104.89,9.83 104.89,17.19 103.49,18.59 v1(102.22,18.59)
SEG20: length 48.7
  Top Layer w0.254: v1(101.84,16.94) 101.58,17.21 U28.14 ; U27.53 84.58,13.52 84.32,13.26 83.3,13.26 81.65,11.61 81.65,9.7 v1(80.63,8.68)
  Bottom Layer w0.254: v1(80.63,8.68) 84.09,5.23 99.4,5.23 104.38,10.21 104.38,16.94 104.13,17.19 102.1,17.19 v1(101.84,16.94)
SEG21: length 43
  Top Layer w0.254: U28.13 101.21,16.71 101.61,16.3 v1(102.99,16.3) ; v1(82.28,7.92) 82.28,11.48 83.55,12.75 84.7,12.75 84.98,13.03 U27.54
  Bottom Layer w0.254: v1(82.28,7.92) 84.62,5.59 93.79,5.59 95.75,7.54 99.05,7.54 103.75,12.24 103.75,15.54 v1(102.99,16.3)
SEG22: length 33.9
  Top Layer w0.254: U28.12 101.18,16.21 101.72,15.67 v1(102.35,15.67) ; v1(82.92,9.7) 82.92,11.35 83.81,12.24 85.21,12.24 85.38,12.41 U27.55
  Bottom Layer w0.254: v1(82.92,9.7) 82.92,10.72 86.09,13.89 98.92,13.89 100.95,15.92 102.1,15.92 v1(102.35,15.67)
SEG23: length 29.2
  Top Layer w0.254: v1(83.68,10.46) 83.68,11.22 84.19,11.73 85.59,11.73 85.78,11.93 U27.56 ; U28.11 100.66,15.71 v1(101.46,14.91)
  Bottom Layer w0.254: v1(101.46,14.91) 100.83,14.91 99.3,13.38 86.47,13.38 86.47,13.26 v1(83.68,10.46)
SEG24: length 20.4
  Top Layer w0.254: v1(91.81,12.62) 92.57,12.62 95.16,15.21 U28.10 ; U27.57 86.18,11.31 85.97,11.1 85.21,11.1 v1(84.7,10.59)
  Bottom Layer w0.254: v1(91.81,12.62) 86.73,12.62 v1(84.7,10.59)
SEG25: length 18.3
  Top Layer w0.254: U27.58 86.58,10.82 v1(86.09,10.34) ; U28.9 98.09,14.65 95.24,14.65 v1(92.44,11.86)
  Bottom Layer w0.254: v1(86.09,10.34) 87.36,11.61 87.62,11.61 87.87,11.86 v1(92.44,11.86)
SEG26: length 35.6
  Top Layer w0.254: U27.59 86.98,7.29 87.75,6.53 102.99,6.53 103.24,6.78 103.24,12.62 101.66,14.21 U28.8
SEG27: length 32.3
  Top Layer w0.254: U27.60 87.38,7.91 v1(88.13,7.16)
  Top Layer w0.305: v1(88.13,7.16) 102.6,7.16 102.6,12.11 101.01,13.71 U28.7
SEG28: length 21.6
  Top Layer w0.254: U27.61 87.78,9.16 v1(88.89,8.05) ; v1(95.62,12.75) 96.08,13.21 U28.6
  Bottom Layer w0.254: v1(95.62,12.75) 93.84,10.97 91.94,10.97 91.68,11.22 88.38,11.22 87.87,10.72 87.87,9.07 v1(88.89,8.05)
SEG29: length 18.2
  Top Layer w0.254: U28.5 96.72,12.71 v1(96.38,12.37) ; v1(89.27,8.94) 89.14,8.94 88.18,9.9 U27.62
  Bottom Layer w0.254: v1(96.38,12.37) 94.48,10.46 89.02,10.46 88.63,10.08 88.63,9.57 v1(89.27,8.94)
SEG30: length 20.5
  Top Layer w0.254: v1(89.9,9.7) 89.02,9.7 88.58,10.14 U27.63 ; v1(100.44,12.24) 100.41,12.21 U28.4
  Bottom Layer w0.254: v1(89.9,9.7) 99.05,9.7 100.44,11.1 v1(100.44,12.24)
SEG31: length 13.8
  Top Layer w0.254: U27.64 88.98,10.46 93.21,10.46 94.45,11.71 U28.3
SIM_CLK: length 29.7
  Top Layer w0.254: v1(75.44,27.18) 76.45,27.18 76.71,26.92 76.71,24.26 76.63,24.18 U12.41
  Bottom Layer w0.254: SIM1.3 65.51,19.08 65.91,18.67 75.82,18.67 75.82,26.8 v1(75.44,27.18)
SIM_DIO: length 26.3
  Top Layer w0.254: v1(77.09,21.59) 76.9,21.78 U12.39
  Bottom Layer w0.254: v1(77.09,21.59) 77.6,21.59 78.61,22.61 78.61,27.81 77.47,28.96 66.93,28.96 66.78,28.8 SIM1.7
SIM_RST: length 11.6
  Top Layer w0.254: v1(73.14,27.61) 73.37,27.38 U12.42
  Bottom Layer w0.254: v1(73.14,27.61) 72.55,28.19 68.07,28.19 68.05,28.17 SIM1.2
TX0: length 40.6
  Top Layer w0.254: U6.26 59.07,39.24 60.58,39.24 v1(60.96,39.62) ; v1(94.49,38.86) U11.35
  Bottom Layer w0.305: v1(94.49,38.86) 94.49,38.07 94.18,37.77 80.72,37.77 78.87,39.62 v1(60.96,39.62)
UART1_RX: length 38.7
  Top Layer w0.254: U11.28 85.6,33.9 82.17,30.47 80.26,30.47 78.49,28.7 60.58,28.7 60.17,28.29 U12.53
UART1_TX: length 39
  Top Layer w0.254: U11.27 84.33,33.71 81.52,30.91 80,30.91 78.17,29.08 59.31,29.08 58.97,28.74 U12.54
VSIM: length 17.6
  Top Layer w0.7: U12.40 v1(77.85,22.98)
  Bottom Layer w0.7: SIM1.1 70.59,26.64 70.74,26.8 73.53,26.8 74.8,28.07 76.84,28.07 77.85,27.05 v1(77.85,22.98)
$1N3425: length 20.3
  Top Layer w0.254: C10.1 64.25,35.05 v1(61.72,35.05) ; U6.6 55.64,42.28 55.5,42.42 v1(54.1,42.42)
  Bottom Layer w0.254: v1(54.1,42.42) 54.1,35.31 54.36,35.05 v1(61.72,35.05)
$1N3562: length 61.9
  Top Layer w0.254: 50.53,38.74 50.79,38.48 52.07,38.48 52.2,38.35 52.2,34.16 52.83,33.53 54.74,33.53 55.37,32.89 55.37,30.61 56.53,30.61 D2.2 ; 50.53,38.74 50.53,43.69 56.13,43.69 56.64,43.18 U6.4 ; 50.53,38.74 50.36,38.91 v1(45.07,38.91) ; U2.3 42.79,61.01 40.63,58.85 v1(40.37,58.85)
  Bottom Layer w0.254: v1(45.07,38.91) 45.07,56.94 43.17,58.85 v1(40.37,58.85)
$1N3573: length 69.6
  Top Layer w0.254: D2.3 v1(60.96,30.67) ; v1(51.69,43.05) 55.88,43.05 56.14,42.79 U6.5
  Top Layer w0.4: v1(51.68,33.45) 48.88,33.45 v1(45.2,37.13) ; v1(41.14,37.26) 41.01,37.39 41.01,58.09 43.44,60.52 U2.2
  Bottom Layer w0.254: v1(51.69,43.05) 51.69,30.99 52,30.67 v1(60.96,30.67)
  Bottom Layer w0.4: v1(45.2,37.13) 45.07,37.26 v1(41.14,37.26)
$1N4092: length 22.4
  Top Layer w0.305: Q1.1 58.98,47.24 56.01,47.24 55.88,47.37 55.88,48.39 57.02,49.53 57.02,51.44 48.51,51.44 48.12,51.04 48.12,47.37 50.02,47.37 R5.2
$1N4095: length 9.9
  Top Layer w0.305: Q2.1 54.72,45.86 54.86,45.72 61.09,45.72 61.72,46.36 R6.2
$1N4302: length 6.8
  Top Layer w0.254: U7.1 75.31,40.51 75.44,40.39 75.44,37.59 R7.2
$1N6426: length 14.1
  Top Layer w0.254: U14.1 48.13,20.45 44.83,20.45 44.7,20.57 44.7,28.07 45.12,28.48 U13.3
$1N6765: length 3.2
  Top Layer w0.7: U16.2 49.5,9.41 R10.1
$1N8518: length 4.4
  Top Layer w0.254: R13.2 63.37,0.89 63.5,0.76 65.79,0.76 65.79,1.49 LED3.2
$1N8521: length 4.5
  Top Layer w0.254: LED4.2 71.63,1.62 71.63,0.76 69.47,0.76 69.47,1.67 R14.2
$1N17733: length 4.8
  Top Layer w0.7: R17.2 13.94,43.85 13.77,43.67 Q3.1
$1N17781: length 23.1
  Top Layer w0.7: R18.1 17.28,54.91 14.59,54.91 13.7,54.02 U30.1 12.31,49.07 9.64,46.4 9.64,40.94 10.26,40.32 Q3.3
$1N18025: length 33.7
  Top Layer w0.7: R19.2 20.18,39.29 21.83,37.64 29.83,37.64 30.59,38.4 30.59,44.75 30.34,45.01 28.31,45.01 28.24,44.94 ; 28.24,44.94 28.24,47.99 27.17,49.07 U31.1 ; 28.24,44.94 Q4.1
$1N20787: length 21.1
  Top Layer w0.7: R21.2 33.77,7.29 34.91,8.43 34.91,16.94 33.52,18.34 U39.7
$1N20791: length 2.7
  Top Layer w0.7: LED5.1 R21.1
$1N20889: length 3.3
  Top Layer w0.7: LED6.2 25.53,12.37 R22.1
$1N20892: length 24.9
  Top Layer w0.254: v1(31.36,9.95) 32.88,11.48 32.88,17.32 32.75,17.45 29.2,17.45 28.82,17.07 U39.6 ; v1(24.5,10.59) 27.29,10.59 27.78,11.08 R22.2
  Bottom Layer w0.254: v1(31.36,9.95) 30.72,10.59 v1(24.5,10.59)
$1N20989: length 8.2
  Top Layer w0.7: U39.2 19.17,18.34 17.64,19.86 14.61,19.86 R23.2
$1N21679: length 8.8
  Top Layer w0.7: Q5.4 7.29,12.43 7.1,12.24 7.1,7.8 7.35,7.54 9.19,7.54 U41.1
$1N21690: length 7.1
  Top Layer w0.7: U41.3 10.14,5.58 10.33,5.76 10.4,5.76 10.4,10.08 9.95,10.53 Q5.6
$1N21695: length 7.9
  Top Layer w0.7: R24.1 7.1,2.97 7.1,6.27 7.35,6.53 U41.2
$1N21874: length 11.1
  Top Layer w0.7: U41.5 12.94,6.53 13.58,7.16 15.37,7.16 R25.1 15.48,7.3 15.48,9.83 16.26,10.6 C16.2
$1N22185: length 6.5
  Top Layer w0.7: 60.32,64.81 60.16,64.64 58.29,64.64 58.29,66.53 57.66,67.17 R8.2

## Copper pours and planes (outline as drawn; the poured copper is in the pictures)
GND on Top Layer: 1.04,68.63 105.65,68.63 105.65,0.81 1.04,0.81
GND on Bottom Layer: 1.04,68.63 105.65,68.63 105.65,0.81 1.04,0.81

## Text on the board
Top Silkscreen Layer: CHRGING | + | u.fL | 3V3 | P+ | P- | GND | 6V SOLAR | LIPO | TX | WATER METER V1 | RX | - | LCD segment
